# EAGLE design EBN_OLED_V01 (EAGLE 7.1.0)
CNAME: EasyBoard Nano; CREVISION: 0.1; DESIGNER: Martin Olejar
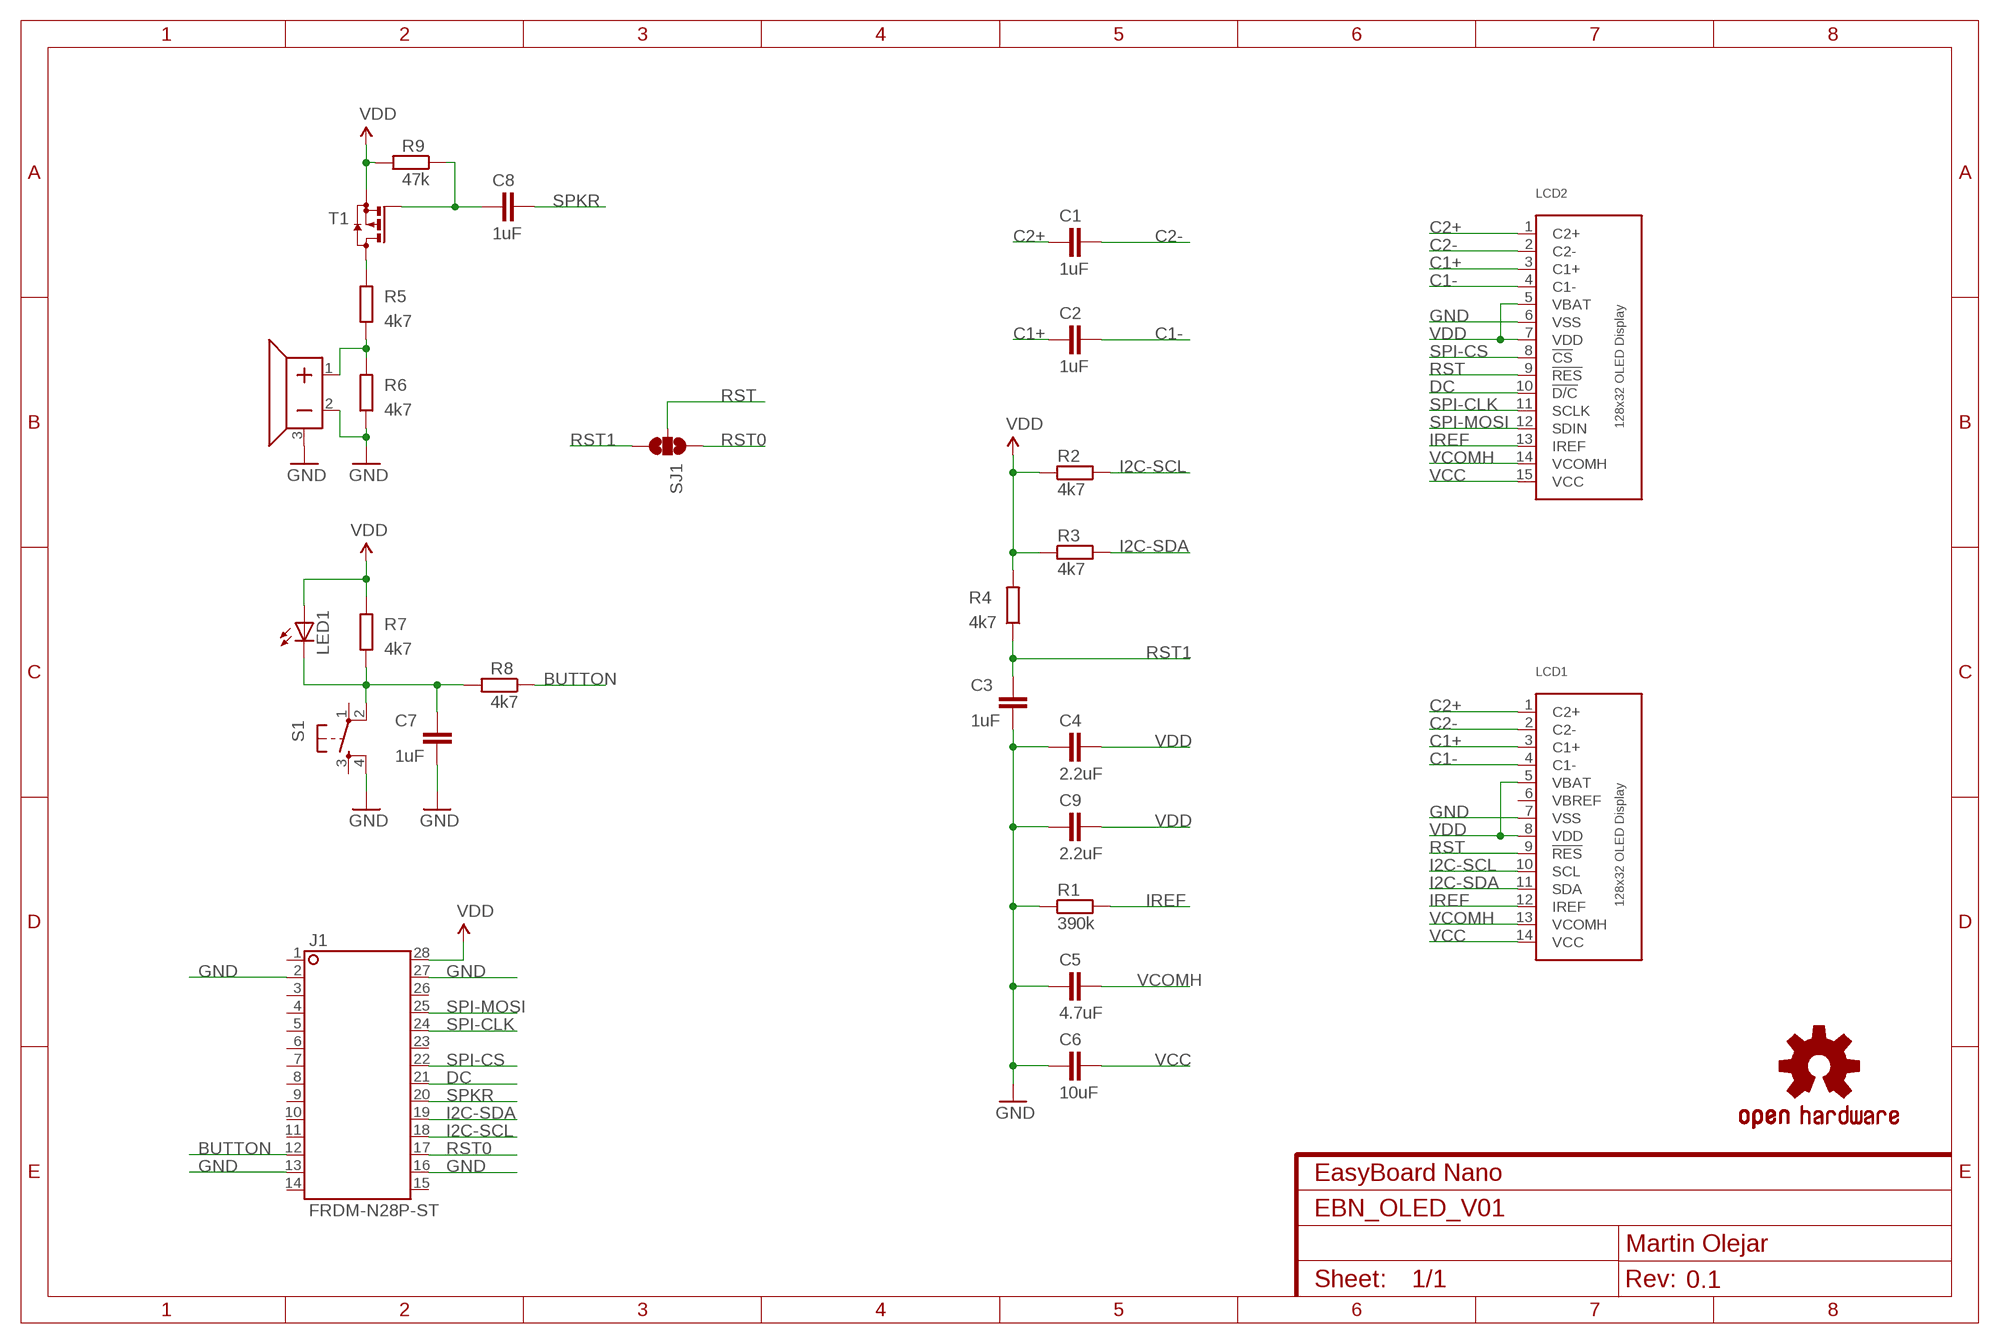
[diagram p0: schematic, sheet 1]

## Parts
C1  1uF  C-EUC0603  [C0603]
C2  1uF  C-EUC0603  [C0603]
C3  1uF  C-EUC0603  [C0603]
C4  2.2uF  C-EUC0603  [C0603]
C5  4.7uF  C-EUC0603  [C0603]
C6  10uF  C-EUC0603  [C0603]
C7  1uF  C-EUC0603  [C0603]
C8  1uF  C-EUC0603  [C0603]
C9  2.2uF  C-EUC0603  [C0603]
J1  FRDM-N28P-ST  [FRDM-N28P-SHIELD]
LCD1  DISP_OLED_UG-2832HSWEG02  [UG-2832HSWEG02_WRAPUNDER]
LCD2  DISP_OLED_UG-2832HSWEG04WRAPAROUND  [UG-2832HSWEG04_WRAPAROUND]
LED1  LEDCHIPLED_0805  [CHIPLED_0805]
LOGO1  OSHW-LOGOS  [OSHW-LOGO-S]
R1  390k  R-EUR0603  [R0603]
R2  4k7  R-EUR0603  [R0603]
R3  4k7  R-EUR0603  [R0603]
R4  4k7  R-EUR0603  [R0603]
R5  4k7  R-EUR0603  [R0603]
R6  4k7  R-EUR0603  [R0603]
R7  4k7  R-EUR0603  [R0603]
R8  4k7  R-EUR0603  [R0603]
R9  47k  R-EUR0603  [R0603]
S1  SWITCH-TACT2  [EVQ-PLX]
SJ1  SJ2W-S  [JUMPER-SMD-S2X]
T1  -PMOS-SOT23  [SOT23]
U$1  SPEAKER  [BUZZER-5MM]

## Nets
BUTTON: J1.12 R8.1
C1+: C2.1 LCD1.3(C1+) LCD2.3(C1+)
C1-: C2.2 LCD1.4(C1-) LCD2.4(C1-)
C2+: C1.1 LCD1.1(C2+) LCD2.1(C2+)
C2-: C1.2 LCD1.2(C2-) LCD2.2(C2-)
DC: J1.21 LCD2.10(!D/C)
GND: C3.1 C4.1 C5.1 C6.1 C7.1 C9.1 J1.2 J1.13 J1.16 J1.27 LCD1.7(VSS) LCD2.6(VSS) R1.1 R6.1 S1.4 U$1.2 U$1.3
I2C-SCL: J1.18 LCD1.10(SCL) R2.2
I2C-SDA: J1.19 LCD1.11(SDA) R3.2
IREF: LCD1.12(IREF) LCD2.13(IREF) R1.2
N$1: R5.2 T1.3(D)
N$2: R5.1 R6.2 U$1.1
N$3: C7.2 LED1.C R7.1 R8.2 S1.2
N$5: C8.1 R9.1 T1.1(G)
RST: LCD1.9(!RES) LCD2.9(!RES) SJ1.2
RST0: J1.17 SJ1.1
RST1: C3.2 R4.1 SJ1.3
SPI-CLK: J1.24 LCD2.11(SCLK)
SPI-CS: J1.22 LCD2.8(!CS)
SPI-MOSI: J1.25 LCD2.12(SDIN)
SPKR: C8.2 J1.20
VCC: C6.2 LCD1.14(VCC) LCD2.15(VCC)
VCOMH: C5.2 LCD1.13(VCOMH) LCD2.14(VCOMH)
VDD: C4.2 C9.2 J1.28 LCD1.5(VBAT) LCD1.8(VDD) LCD2.5(VBAT) LCD2.7(VDD) LED1.A R2.1 R3.1 R4.2 R7.2 R9.2 T1.2(S)
Unconnected: J1.1 J1.3 J1.4 J1.5 J1.6 J1.7 J1.8 J1.9 J1.10 J1.11 J1.14 J1.15 J1.23 J1.26 S1.1 S1.3

## Power pins joined to a net without a drawn wire
VBREF: LCD1.6(VBREF)

## Library data of the parts
C1-C9 = atomx_RLC:C-EU: CAPACITOR, European symbol
J1 = atomx_Boards:FRDM-N28P: Dual In Line
LCD1 = atomx_Others:DISP_OLED_UG-2832HSWEG02: 128x32 I2C 0.91" Monochrome OLED Display
LCD2 = atomx_Others:DISP_OLED_UG-2832HSWEG04: 128x32 SPI 0.91" Monochrome OLED Display
LED1 = led:LED: LED OSRAM: - CHIPLED LG R971, LG N971, LY N971, LG Q971, LY Q971, LO R971, LY R971 LH N974, LH R974 LS Q976, LO Q976, LY Q976 LO Q996 - Hyper CHIPLED LW Q18S LB Q993, LB Q99A, LB R99A - SideLED LS A670, LO A670, LY A670, LG A670, LP A670 LB A673, LV A673, LT A673, LW A673 LH A674 LY A675 LS A676, LA A676, LO A676, LY A676, LW A676 LS A679, LY A679, LG A679 - Hyper Micro SIDELED® LS Y876, LA Y876, LO Y876, LY Y876 LT Y87S - SmartLED LW L88C, LW L88S LB L89C, LB L89S, LG L890 LS L89K, LO L89K, LY L89K LS L896, LA L896, LO L896, LY L896 - TOPLED LS T670, LO T670, LY T670, LG T670, LP T670 LSG T670, LSP T670, LSY T670, LOP T670, LYG T670 LG T671, LOG T671, LSG T671 LB T673, LV T673, LT T673, LW T673 LH T674 LS T676, LA T676, LO T676, LY T676, LB T676, LH T676, LSB T676, LW T676 LB T67C, LV T67C, LT T67C, LS T67K, LO T67K, LY T67K, LW E67C LS E67B, LA E67B, LO E67B, LY E67B, LB E67C, LV E67C, LT E67C LW T67C LS T679, LY T679, LG T679 LS T770, LO T770, LY T770, LG T770, LP T770 LB T773, LV T773, LT T773, LW T773 LH T774 LS E675, LA E675, LY E675, LS T675 LS T776, LA T776, LO T776, LY T776, LB T776 LHGB T686 LT T68C, LB T68C - Hyper Mini TOPLED® LB M676 - Mini TOPLED Santana® LG M470 LS M47K, LO M47K, LY M47K Source: http://www.osram.convergy.de LUXEON: - LUMILED® LXK2-PW12-R00, LXK2-PW12-S00, LXK2-PW14-U00, LXK2-PW14-V00 LXK2-PM12-R00, LXK2-PM12-S00, LXK2-PM14-U00 LXK2-PE12-Q00, LXK2-PE12-R00, LXK2-PE12-S00, LXK2-PE14-T00, LXK2-PE14-U00 LXK2-PB12-K00, LXK2-PB12-L00, LXK2-PB12-M00, LXK2-PB14-N00, LXK2-PB14-P00, LXK2-PB14-Q00 LXK2-PR12-L00, LXK2-PR12-M00, LXK2-PR14-Q00, LXK2-PR14-R00 LXK2-PD12-Q00, LXK2-PD12-R00, LXK2-PD12-S00 LXK2-PH12-R00, LXK2-PH12-S00 LXK2-PL12-P00, LXK2-PL12-Q00, LXK2-PL12-R00 Source: www.luxeon.com KINGBRIGHT: KA-3528ASYC Source: www.kingbright.com
LOGO1 = atomx_Common:OSHW-LOGO: Open Source Hardware Logo This logo indicates the piece of hardware it is found on incorporates a OSHW license and/or adheres to the definition of open source hardware found here: http://freedomdefined.org/OSHW
R1-R9 = atomx_RLC:R-EU: RESISTOR, European symbol
S1 = atomx_ElecMech:SWITCH-TACT2
SJ1 = atomx_Connectors:SJ2W: SMD solder JUMPER
T1 = atomx_DiscreteSemi:*-PMOS-
U$1 = atomx_ElecMech:SPEAKER

## Board
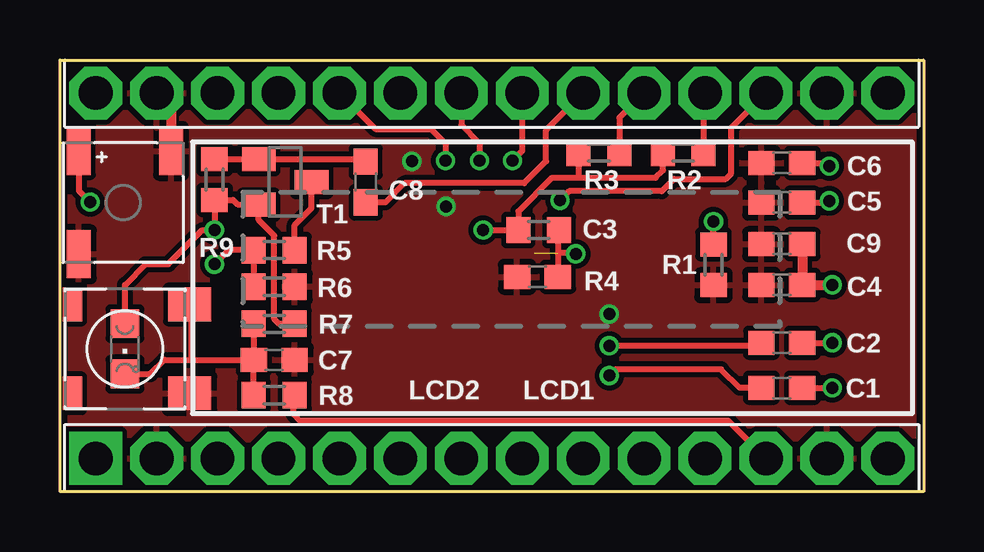
[diagram p1: board, top side]
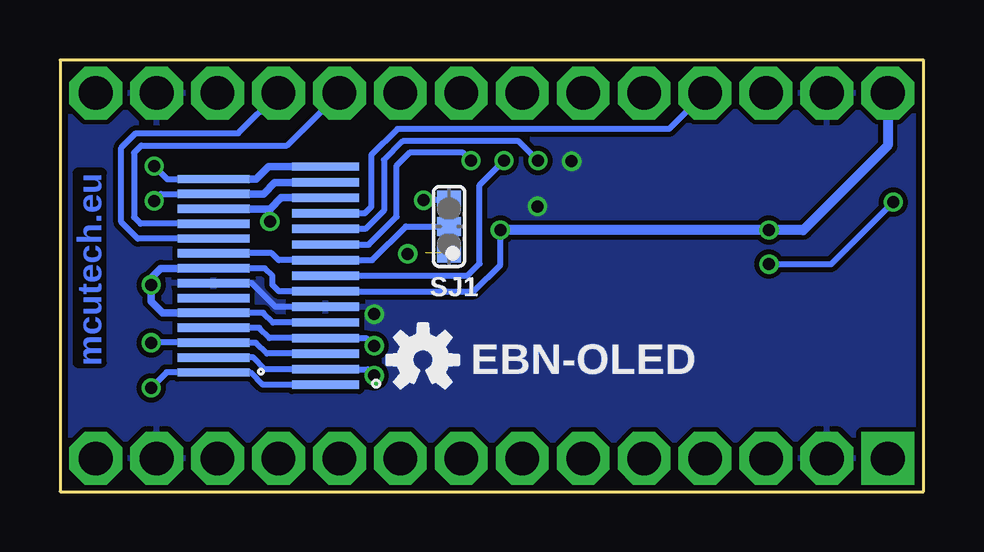
[diagram p2: board, bottom side, seen from below]

Size 36 x 18 mm. Coordinates in mm from the lower left corner, seen from the top.
Copper layers (1*16): Top 0.035mm / dielectric 1.5mm / Bottom 0.035mm
Design rules "ITEADstudio_DRC *": minimum track width 6mil, minimum drill 12mil, track to track 8mil, track to pad 8mil, pad to pad 8mil, via to via 8mil, smd to smd 0mil, copper to edge 10mil, drill to drill 10mil, minimum pad ring 10mil, minimum via ring 6mil, stop-mask expansion 2mil, vias tented up to drill 100mil, thermal gap 10mil

### Footprints (pad centres in the part's own frame; a part is rotated, then mirrored left to right if it is on the bottom)
C0603 = smd 1.1 x 1: 1 -0.85,0; 2 0.85,0
FRDM-N28P-SHIELD = drill 1.4 pad 2.2 square: 1 -16.51,-7.62 | drill 1.4 pad 2.2 octagon: 2 -13.97,-7.62; 3 -11.43,-7.62; 4 -8.89,-7.62; 5 -6.35,-7.62; 6 -3.81,-7.62; 7 -1.27,-7.62; 8 1.27,-7.62; 9 3.81,-7.62; 10 6.35,-7.62; 11 8.89,-7.62; 12 11.43,-7.62; 13 13.97,-7.62; 14 16.51,-7.62; 15 16.51,7.62; 16 13.97,7.62; 17 11.43,7.62; 18 8.89,7.62; 19 6.35,7.62; 20 3.81,7.62; 21 1.27,7.62; 22 -1.27,7.62; 23 -3.81,7.62; 24 -6.35,7.62; 25 -8.89,7.62; 26 -11.43,7.62; 27 -13.97,7.62; 28 -16.51,7.62
UG-2832HSWEG02_WRAPUNDER = smd 3 x 0.35 bottom: 1 -5.93,-4.03; 2 -5.93,-3.41; 3 -5.93,-2.79; 4 -5.93,-2.17; 5 -5.93,-1.55; 6 -5.93,-0.93; 7 -5.93,-0.31; 8 -5.93,0.31; 9 -5.93,0.93; 10 -5.93,1.55; 11 -5.93,2.17; 12 -5.93,2.79; 13 -5.93,3.41; 14 -5.93,4.03
UG-2832HSWEG04_WRAPAROUND = smd 2.8 x 0.35 bottom: 1 -10.6,-4.55; 2 -10.6,-3.9; 3 -10.6,-3.25; 4 -10.6,-2.6; 5 -10.6,-1.95; 6 -10.6,-1.3; 7 -10.6,-0.65; 8 -10.6,0; 9 -10.6,0.65; 10 -10.6,1.3; 11 -10.6,1.95; 12 -10.6,2.6; 13 -10.6,3.25; 14 -10.6,3.9; 15 -10.6,4.55
CHIPLED_0805 = smd 1.2 x 1.2: A 0,-1.05; C 0,1.05
R0603 = smd 1 x 1.1: 1 -0.85,0; 2 0.85,0
EVQ-PLX = smd 0.8 x 1.4: 1 -2.192,1.85; 3 -2.192,-1.85 | smd 1.8 x 1.4: 2 2.7,1.85; 4 2.7,-1.85
JUMPER-SMD-S2X = smd 0.8 x 1: 1 -1.1,0; 2 0,0; 3 1.1,0
SOT23 = smd 1 x 1.4: 1 -0.95,-1.1; 2 0.95,-1.1; 3 0,1.1
BUZZER-5MM = smd 2 x 1: 1 -2.15,-1.85; 2 -2.15,2; 3 2.15,-1.85

### Placement (x,y rotation side)
C1  30.09,4.33 180 top
C2  30.09,6.21 180 top
C3  19.9,8.95 0 top
C4  30.09,8.62 0 top
C5  30.09,12.05 0 top
C6  30.09,13.7 0 top
C7  8.93,5.49 180 top
C8  12.74,12.91 270 top
C9  30.09,10.32 0 top
J1  18,9 0 top
LCD1  35.53,9 0 top
LCD2  35.53,9 0 top
LED1  2.71,5.95 180 top
LOGO1  20.87,5.49 0 bottom
R1  27.25,9.46 90 top
R2  25.98,14.13 0 top
R3  22.47,14.13 0 top
R4  19.96,10.9 180 top
R5  8.93,10.07 0 top
R6  8.93,8.54 180 top
R7  8.93,6.99 0 top
R8  8.93,4.02 180 top
R9  6.44,13.01 270 top
S1  2.71,5.95 0 top
SJ1  19.78,11.06 270 bottom
T1  9.39,12.91 270 top
U$1  2.63,12.05 270 top

### Tracks (layer width: path | path; a pad name or v marks a point on that pad's centre or on a via)
BUTTON
  Top 0.254: J1.12 27.86,2.95 10,2.95 9.75,3.21 9.75,4.04 R8.1
C1+  (via drill 0.5)
  Top 0.254: C2.1 v32.2,6.21
  Bottom 0.254: LCD2.3 27.37,5.75 27.83,6.21 30.67,6.21 | LCD1.3 v32.19,6.21 v32.2,6.21
  Bottom 0.305: 30.67,6.21 LCD1.3
C1-  (via drill 0.5)
  Top 0.254: C2.2 29.24,6.08 v22.9,6.08
  Bottom 0.254: LCD1.4 27.69,6.83 27.26,6.4 LCD2.4 23.22,6.4 v22.9,6.08
C2+  (via drill 0.5)
  Top 0.254: C1.1 v32.2,4.33
  Bottom 0.254: LCD2.1 27.55,4.45 28.06,4.96 30.67,4.96 | LCD1.1 31.56,4.97 v32.2,4.33
  Bottom 0.305: 30.67,4.96 LCD1.1
C2-  (via drill 0.5)
  Top 0.254: C1.2 28.34,4.32 27.56,5.1 23.17,5.1 v22.9,4.83
  Bottom 0.254: LCD1.2 30.67,5.6 27.96,5.6 27.46,5.1 LCD2.2 23.17,5.1 v22.9,4.83
DC  (via drill 0.5)
  Top 0.254: J1.21 19.27,14.21 v18.86,13.8
  Bottom 0.254: v18.86,13.8 19.19,14.13 21.43,14.13 21.96,13.6 21.96,11.46 23.13,10.3 LCD2.10
GND  (via drill 0.5)
  Top 0.406: J1.27 4.63,16.02 U$1.2
  Bottom 0.254: LCD2.6 27.01,7.7 28.01,8.69 30.52,8.69
  Bottom 0.305: 30.67,8.7 30.52,8.69 LCD1.7
  other vias: 22.9,7.4 14.67,13.78 16.09,11.9
  pour Bottom: -0.01,18.02 36.01,18.02 36.01,0.01 -0.01,0.01
  pour Top: -0.01,18.02 35.98,18.02 35.98,0.01 -0.01,0.01
I2C-SCL
  Top 0.254: J1.18 26.83,16.56 R2.2
  Bottom 0.254: 30.68,10.55 32.76,10.55 33.44,11.24 33.44,14.33 32.83,14.94 28.57,14.94 J1.18
  Bottom 0.305: 30.68,10.55 LCD1.10
I2C-SDA
  Top 0.254: 23.03,14.2 R3.2 23.32,15.59 J1.19
  Bottom 0.254: LCD1.11 32.64,11.17 32.91,11.44 32.91,14.13 32.61,14.44 26.53,14.44 J1.19
IREF  (via drill 0.5)
  Top 0.254: R1.2 v27.25,11.26
  Bottom 0.254: 27.25,11.79 27.25,11.67 v27.25,11.26
  Bottom 0.305: LCD1.12 27.25,11.79 26.79,12.25 26.31,12.25 LCD2.13
N$1
  Top 0.254: R5.2 9.78,11.12 10.48,11.82 T1.3
N$2  (via drill 0.5)
  Top 0.254: U$1.1 0.78,12.55 v1.26,12.07 | R6.2 R5.1 7.03,10.07 v6.44,9.48
  Bottom 0.254: v6.44,9.48 3.85,9.48 v1.26,12.07
N$3
  Top 0.254: LED1.C 3.77,4.9 4.36,5.49 5.48,5.49 | R7.1 C7.2 | R8.2 C7.2 | 5.48,5.49 C7.2 | S1.2 5.48,7.73 5.48,5.49
N$5
  Top 0.254: R9.1 T1.1 12.64,13.86 C8.1
RST
  Bottom 0.254: LCD1.9 30.67,9.94 27.17,9.94 26.88,9.65 LCD2.9 22.99,9.65 21.58,11.06 SJ1.2
RST0  (via drill 0.5)
  Top 0.254: v20.84,12.15 21.23,12.53 25.09,12.53 25.59,13.04 27.75,13.04 27.98,13.27 27.98,15.17 J1.17
  Bottom 0.254: SJ1.1 20.8,12.16 v20.84,12.15
RST1  (via drill 0.5)  (1 unrouted)
  Top 0.254: 20.81,9.08 C3.2 20.76,9.94 | R4.1 20.76,10.85 20.76,9.94 | v21.51,9.91 21.48,9.94 20.76,9.94
SPI-CLK  (via drill 0.5)
  Top 0.254: J1.24 13.15,15.12 15.46,15.12 16.07,14.51 v16.07,13.8
  Bottom 0.254: v16.07,13.8 16.88,14.61 21.71,14.61 22.5,13.83 22.5,11.72 23.26,10.95 LCD2.11
SPI-CS  (via drill 0.5)
  Top 0.254: v17.49,13.8 17.49,14.54 16.73,15.3 J1.22
  Bottom 0.254: LCD2.8 19.02,9 18.51,9.51 18.51,12.78 v17.49,13.8
SPI-MOSI
  Bottom 0.254: 24.29,11.6 LCD2.12 23.3,11.6 23.03,11.87 23.03,14.03 21.94,15.12 10.61,15.12 J1.25
SPKR
  Top 0.254: J1.20 20.26,15.07 20.26,13.78 19.35,12.86 14.37,12.86 13.57,12.06 C8.2
VCC  (via drill 0.5)
  Top 0.254: C6.2 32.02,13.7 v32.07,13.57
  Bottom 0.254: v32.07,13.57 31.53,13.03 LCD1.14
  Bottom 0.305: LCD1.14 27.81,13.03 27.3,13.55 26.31,13.55 LCD2.15
VCOMH  (via drill 0.5)
  Top 0.254: C5.2 32.07,12.05 v32.07,12.12
  Bottom 0.254: v32.07,12.12 31.79,12.41 LCD1.13
  Bottom 0.305: LCD1.13 27.52,12.41 27.04,12.89 26.32,12.89 LCD2.14
VDD  (via drill 0.5)
  Top 0.254: 21.68,13.09 20.51,13.09 19.11,11.68 R4.2 v17.64,10.91 | 21.68,13.09 24.83,13.09 25.14,13.39 25.14,14.17 R2.1 | R3.1 21.62,13.15 21.68,13.09 | LED1.A 2.71,8.62 3.57,9.48 4.51,9.48 5.94,10.91 v6.44,10.91 R9.2 7.22,12.16 7.41,11.97 8.28,11.97 T1.2 8.29,11.32 8.93,10.68 8.93,7.2 9.14,6.99 R7.2
  Top 0.406: v32.2,8.62 C4.2 C9.2
  Bottom 0.254: LCD2.5 27.12,7.05 27.53,7.45 30.68,7.45 LCD1.5 | LCD1.8 27.45,9.31 27.14,9 27.14,8.62 26.88,8.35 LCD2.7 18.75,8.35 17.64,9.46 v17.64,10.91
  Bottom 0.305: LCD1.5 31.72,7.45 32.2,7.93 v32.2,8.62 32.2,8.9 31.79,9.3 30.68,9.3 LCD1.8
  Bottom 0.406: J1.28 1.49,14.44 5.02,10.91 v6.44,10.91 v17.64,10.91

### Text on the board
Bottom: mcutech.eu
bPlace: EBN-OLED